# EasyEDA Pro project uven2-mk3-cc-driver-25x.eprj, board PCB1
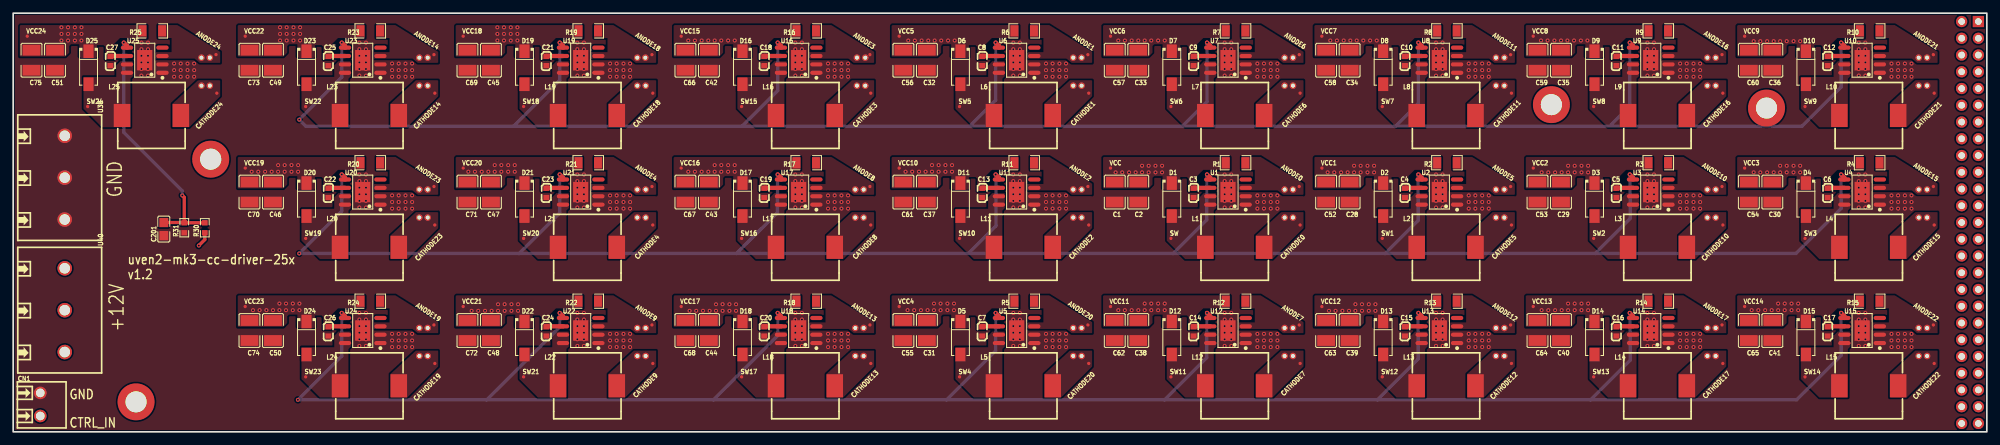
[diagram p2: board, top side]
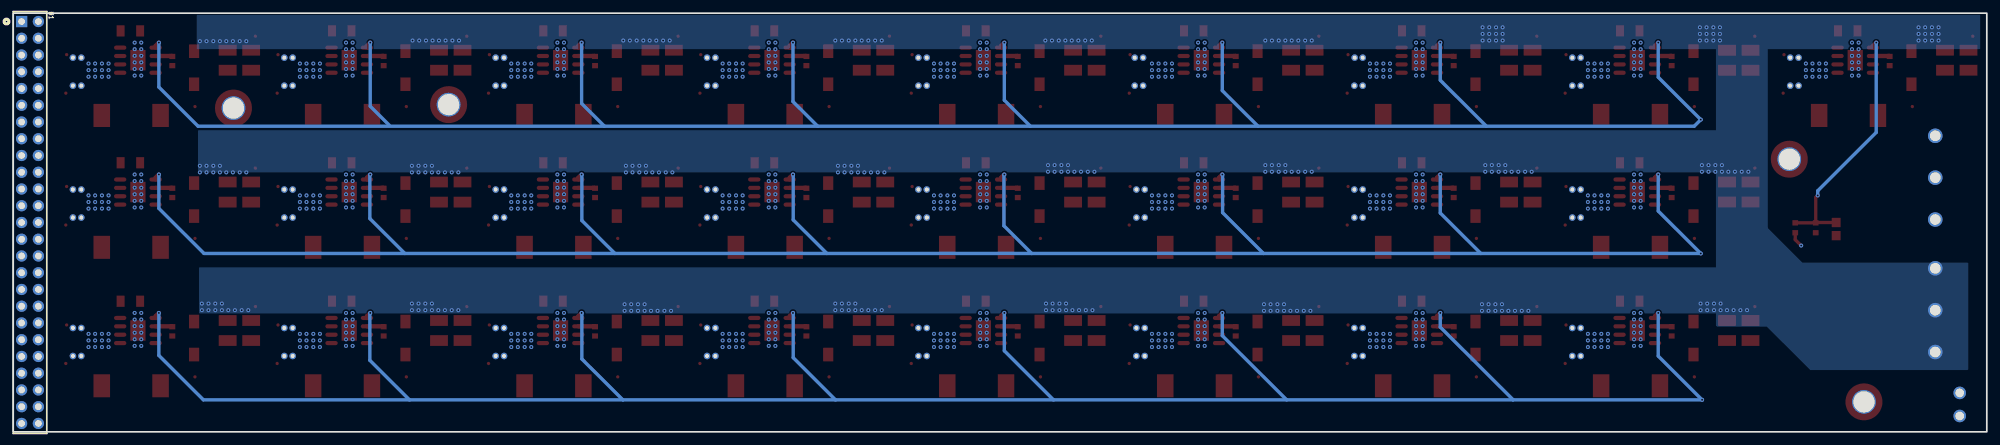
[diagram p3: board, bottom side, seen from below]

Outline 298.79 x 63.5 mm; copper layers: Top Layer, Inner1, Inner2, Bottom Layer. Coordinates in mm from the lower left corner of the outline.
Outline path: rectangle 0,63.5 298.79,0
Stack: Top Layer 0.035mm Outer layer thickness 1oz / Dielectric1 0.2104mm 7628 RC49% 8.6mil / Inner1 0.0152mm Inner layer thickness / Dielectric2 1.065mm 1.1mm H/HOZ Copper / Inner2 0.0152mm Inner layer thickness / Dielectric3 0.2104mm 7628 RC49% 8.6mil / Bottom Layer 0.035mm Outer layer thickness 1oz

## Design rules (mm)
template: Custom Config
spacing copperThickness1oz: track to track 0.102, other pairs 0.152 to 0.3
spacing copperThickness2oz (default): track to track 0.17, other pairs 0.152 to 0.3
track width copperThickness1oz (default): min 0.127, default 0.254, max 2.54
track width copperThickness2oz: min 0.203, default 0.254, max 2.54
differential pair differentialPair (default): width min 0.127, default 0.254, max 2.54; gap min 0.152, default 0.152
via viaSize (default): diameter min 0.5, default 0.61, max 10; hole min 0.3, default 0.305, max 6.3
pour e614 uses copperRegion
pour e1122 uses copperRegion
pour e1120 uses copperRegion
pour e1121 uses copperRegion
pour e1054 uses copperRegion
pour e1053 uses copperRegion
pour e1055 uses copperRegion
pour e1052 uses copperRegion
pour e917 uses copperRegion
pour e918 uses copperRegion
pour e916 uses copperRegion
pour e919 uses copperRegion
pour e815 uses copperRegion
pour e816 uses copperRegion
pour e817 uses copperRegion
pour e814 uses copperRegion
pour e475 uses copperRegion
pour e476 uses copperRegion
pour e474 uses copperRegion
pour e477 uses copperRegion
pour e509 uses copperRegion
pour e510 uses copperRegion
pour e508 uses copperRegion
pour e511 uses copperRegion
pour e543 uses copperRegion
pour e544 uses copperRegion
pour e542 uses copperRegion
pour e545 uses copperRegion
pour e579 uses copperRegion
pour e578 uses copperRegion
pour e577 uses copperRegion
pour e576 uses copperRegion
pour e611 uses copperRegion
pour e612 uses copperRegion
pour e610 uses copperRegion
pour e613 uses copperRegion
pour e782 uses copperRegion
pour e783 uses copperRegion
pour e780 uses copperRegion
pour e781 uses copperRegion
pour e749 uses copperRegion
pour e748 uses copperRegion
pour e746 uses copperRegion
pour e747 uses copperRegion
pour e714 uses copperRegion
pour e713 uses copperRegion
pour e712 uses copperRegion
pour e715 uses copperRegion
pour e680 uses copperRegion
pour e679 uses copperRegion
pour e678 uses copperRegion
pour e681 uses copperRegion
pour e442 uses copperRegion
pour e441 uses copperRegion
pour e440 uses copperRegion
pour e443 uses copperRegion
pour e884 uses copperRegion
pour e883 uses copperRegion
pour e882 uses copperRegion
pour e885 uses copperRegion
pour e1020 uses copperRegion
pour e1018 uses copperRegion
pour e1019 uses copperRegion
pour e1021 uses copperRegion
pour e1088 uses copperRegion
pour e1087 uses copperRegion
pour e1086 uses copperRegion
pour e1089 uses copperRegion
pour e409 uses copperRegion
pour e406 uses copperRegion
pour e407 uses copperRegion
pour e408 uses copperRegion
pour e374 uses copperRegion
pour e375 uses copperRegion
pour e372 uses copperRegion
pour e373 uses copperRegion
pour e339 uses copperRegion
pour e338 uses copperRegion
pour e341 uses copperRegion
pour e340 uses copperRegion
pour e305 uses copperRegion
pour e304 uses copperRegion
pour e307 uses copperRegion
pour e306 uses copperRegion
pour e646 uses copperRegion
pour e645 uses copperRegion
pour e644 uses copperRegion
pour e647 uses copperRegion
pour e849 uses copperRegion
pour e848 uses copperRegion
pour e850 uses copperRegion
pour e851 uses copperRegion
pour e984 uses copperRegion
pour e985 uses copperRegion
pour e986 uses copperRegion
pour e987 uses copperRegion
pour e951 uses copperRegion
pour e950 uses copperRegion
pour e953 uses copperRegion
pour e952 uses copperRegion
pour e2573 uses copperRegion
pour e2685 uses copperRegion
pour e2724 uses copperRegion
pour e2941 uses copperRegion
pour e2625 uses copperRegion

## Placement (name value [footprint] x y rotation side)
ANODE0  -  [Test-Point-0.5mm]  194.7 37.21 0 top
ANODE1  -  [Test-Point-0.5mm]  162.7 57.21 0 top
ANODE2  -  [Test-Point-0.5mm]  162.7 37.21 0 top
ANODE3  -  [Test-Point-0.5mm]  129.7 57.21 0 top
ANODE4  -  [Test-Point-0.5mm]  96.7 37.21 0 top
ANODE5  -  [Test-Point-0.5mm]  226.7 37.21 0 top
ANODE6  -  [Test-Point-0.5mm]  194.7 57.21 0 top
ANODE7  -  [Test-Point-0.5mm]  194.7 16.21 0 top
ANODE8  -  [Test-Point-0.5mm]  129.7 37.21 0 top
ANODE9  -  [Test-Point-0.5mm]  96.7 16.21 0 top
ANODE10  -  [Test-Point-0.5mm]  258.7 37.21 0 top
ANODE11  -  [Test-Point-0.5mm]  226.7 57.21 0 top
ANODE12  -  [Test-Point-0.5mm]  226.7 16.21 0 top
ANODE13  -  [Test-Point-0.5mm]  129.7 16.21 0 top
ANODE14  -  [Test-Point-0.5mm]  63.7 57.21 0 top
ANODE15  -  [Test-Point-0.5mm]  290.7 37.21 0 top
ANODE16  -  [Test-Point-0.5mm]  258.7 57.21 0 top
ANODE17  -  [Test-Point-0.5mm]  258.7 16.21 0 top
ANODE18  -  [Test-Point-0.5mm]  96.7 57.21 0 top
ANODE19  -  [Test-Point-0.5mm]  63.7 16.21 0 top
ANODE20  -  [Test-Point-0.5mm]  162.7 16.21 0 top
ANODE21  -  [Test-Point-0.5mm]  290.7 57.21 0 top
ANODE22  -  [Test-Point-0.5mm]  290.7 16.21 0 top
ANODE23  -  [Test-Point-0.5mm]  63.7 37.21 0 top
ANODE24  -  [Test-Point-0.5mm]  30.7 57.21 0 top
C1  4.7uF  [C1210]  166.77 36.36 90 top
C2  4.7uF  [C1210]  170.32 36.36 90 top
C3  100nF  [C0603]  178.71 36.24 90 top
C4  100nF  [C0603]  210.71 36.24 90 top
C5  100nF  [C0603]  242.71 36.24 90 top
C6  100nF  [C0603]  274.71 36.24 90 top
C7  100nF  [C0603]  146.71 15.24 90 top
C8  100nF  [C0603]  146.71 56.24 90 top
C9  100nF  [C0603]  178.71 56.24 90 top
C10  100nF  [C0603]  210.71 56.24 90 top
C11  100nF  [C0603]  242.71 56.24 90 top
C12  100nF  [C0603]  274.71 56.24 90 top
C13  100nF  [C0603]  146.71 36.24 90 top
C14  100nF  [C0603]  178.71 15.24 90 top
C15  100nF  [C0603]  210.71 15.24 90 top
C16  100nF  [C0603]  242.71 15.24 90 top
C17  100nF  [C0603]  274.71 15.24 90 top
C18  100nF  [C0603]  113.71 56.24 90 top
C19  100nF  [C0603]  113.71 36.24 90 top
C20  100nF  [C0603]  113.71 15.24 90 top
C21  100nF  [C0603]  80.71 56.24 90 top
C22  100nF  [C0603]  47.71 36.24 90 top
C23  100nF  [C0603]  80.71 36.24 90 top
C24  100nF  [C0603]  80.71 15.24 90 top
C25  100nF  [C0603]  47.71 56.24 90 top
C26  100nF  [C0603]  47.71 15.24 90 top
C27  100nF  [C0603]  14.71 56.24 90 top
C28  4.7uF  [C1210]  202.32 36.36 90 top
C29  4.7uF  [C1210]  234.32 36.36 90 top
C30  4.7uF  [C1210]  266.32 36.36 90 top
C31  4.7uF  [C1210]  138.32 15.36 90 top
C32  4.7uF  [C1210]  138.32 56.36 90 top
C33  4.7uF  [C1210]  170.32 56.36 90 top
C34  4.7uF  [C1210]  202.32 56.36 90 top
C35  4.7uF  [C1210]  234.32 56.36 90 top
C36  4.7uF  [C1210]  266.32 56.36 90 top
C37  4.7uF  [C1210]  138.32 36.36 90 top
C38  4.7uF  [C1210]  170.32 15.36 90 top
C39  4.7uF  [C1210]  202.32 15.36 90 top
C40  4.7uF  [C1210]  234.32 15.36 90 top
C41  4.7uF  [C1210]  266.32 15.36 90 top
C42  4.7uF  [C1210]  105.33 56.36 90 top
C43  4.7uF  [C1210]  105.33 36.36 90 top
C44  4.7uF  [C1210]  105.33 15.36 90 top
C45  4.7uF  [C1210]  72.33 56.36 90 top
C46  4.7uF  [C1210]  39.33 36.36 90 top
C47  4.7uF  [C1210]  72.33 36.36 90 top
C48  4.7uF  [C1210]  72.33 15.36 90 top
C49  4.7uF  [C1210]  39.33 56.36 90 top
C50  4.7uF  [C1210]  39.33 15.36 90 top
C51  4.7uF  [C1210]  6.33 56.36 90 top
C52  4.7uF  [C1210]  198.77 36.36 90 top
C53  4.7uF  [C1210]  230.77 36.36 90 top
C54  4.7uF  [C1210]  262.77 36.36 90 top
C55  4.7uF  [C1210]  134.77 15.36 90 top
C56  4.7uF  [C1210]  134.77 56.36 90 top
C57  4.7uF  [C1210]  166.77 56.36 90 top
C58  4.7uF  [C1210]  198.77 56.36 90 top
C59  4.7uF  [C1210]  230.77 56.36 90 top
C60  4.7uF  [C1210]  262.77 56.36 90 top
C61  4.7uF  [C1210]  134.77 36.36 90 top
C62  4.7uF  [C1210]  166.77 15.36 90 top
C63  4.7uF  [C1210]  198.77 15.36 90 top
C64  4.7uF  [C1210]  230.77 15.36 90 top
C65  4.7uF  [C1210]  262.77 15.36 90 top
C66  4.7uF  [C1210]  101.77 56.36 90 top
C67  4.7uF  [C1210]  101.77 36.36 90 top
C68  4.7uF  [C1210]  101.77 15.36 90 top
C69  4.7uF  [C1210]  68.77 56.36 90 top
C70  4.7uF  [C1210]  35.77 36.36 90 top
C71  4.7uF  [C1210]  68.77 36.36 90 top
C72  4.7uF  [C1210]  68.77 15.36 90 top
C73  4.7uF  [C1210]  35.77 56.36 90 top
C74  4.7uF  [C1210]  35.77 15.36 90 top
C75  4.7uF  [C1210]  2.77 56.36 90 top
C201  1uF  [C0805]  22.8 30.75 90 top
CATHODE0  -  [Test-Point-0.5mm]  194.83 31.37 0 top
CATHODE1  -  [Test-Point-0.5mm]  162.83 51.37 0 top
CATHODE2  -  [Test-Point-0.5mm]  162.83 31.37 0 top
CATHODE3  -  [Test-Point-0.5mm]  129.83 51.37 0 top
CATHODE4  -  [Test-Point-0.5mm]  96.83 31.37 0 top
CATHODE5  -  [Test-Point-0.5mm]  226.83 31.37 0 top
CATHODE6  -  [Test-Point-0.5mm]  194.83 51.37 0 top
CATHODE7  -  [Test-Point-0.5mm]  194.83 10.37 0 top
CATHODE8  -  [Test-Point-0.5mm]  129.83 31.37 0 top
CATHODE9  -  [Test-Point-0.5mm]  96.83 10.37 0 top
CATHODE10  -  [Test-Point-0.5mm]  258.83 31.37 0 top
CATHODE11  -  [Test-Point-0.5mm]  226.83 51.37 0 top
CATHODE12  -  [Test-Point-0.5mm]  226.83 10.37 0 top
CATHODE13  -  [Test-Point-0.5mm]  129.83 10.37 0 top
CATHODE14  -  [Test-Point-0.5mm]  63.83 51.37 0 top
CATHODE15  -  [Test-Point-0.5mm]  290.83 31.37 0 top
CATHODE16  -  [Test-Point-0.5mm]  258.83 51.37 0 top
CATHODE17  -  [Test-Point-0.5mm]  258.83 10.37 0 top
CATHODE18  -  [Test-Point-0.5mm]  96.83 51.37 0 top
CATHODE19  -  [Test-Point-0.5mm]  63.83 10.37 0 top
CATHODE20  -  [Test-Point-0.5mm]  162.83 10.37 0 top
CATHODE21  -  [Test-Point-0.5mm]  290.83 51.37 0 top
CATHODE22  -  [Test-Point-0.5mm]  290.83 10.37 0 top
CATHODE23  -  [Test-Point-0.5mm]  63.83 31.37 0 top
CATHODE24  -  [Test-Point-0.5mm]  30.83 51.37 0 top
CN1  DG381-3.5-02P-14-00A(H)  [CONN-TH_2P-P3.50_DG381-3.5-02P-14-00A]  4.1 4.15 270 top
D1  SS54  [SMA_L4.4-W2.8-LS5.4-R-RD]  175.41 35.22 270 top
D2  SS54  [SMA_L4.4-W2.8-LS5.4-R-RD]  207.41 35.22 270 top
D3  SS54  [SMA_L4.4-W2.8-LS5.4-R-RD]  239.41 35.22 270 top
D4  SS54  [SMA_L4.4-W2.8-LS5.4-R-RD]  271.4 35.22 270 top
D5  SS54  [SMA_L4.4-W2.8-LS5.4-R-RD]  143.41 14.22 270 top
D6  SS54  [SMA_L4.4-W2.8-LS5.4-R-RD]  143.41 55.22 270 top
D7  SS54  [SMA_L4.4-W2.8-LS5.4-R-RD]  175.41 55.22 270 top
D8  SS54  [SMA_L4.4-W2.8-LS5.4-R-RD]  207.41 55.22 270 top
D9  SS54  [SMA_L4.4-W2.8-LS5.4-R-RD]  239.41 55.22 270 top
D10  SS54  [SMA_L4.4-W2.8-LS5.4-R-RD]  271.4 55.22 270 top
D11  SS54  [SMA_L4.4-W2.8-LS5.4-R-RD]  143.41 35.22 270 top
D12  SS54  [SMA_L4.4-W2.8-LS5.4-R-RD]  175.41 14.22 270 top
D13  SS54  [SMA_L4.4-W2.8-LS5.4-R-RD]  207.41 14.22 270 top
D14  SS54  [SMA_L4.4-W2.8-LS5.4-R-RD]  239.41 14.22 270 top
D15  SS54  [SMA_L4.4-W2.8-LS5.4-R-RD]  271.4 14.22 270 top
D16  SS54  [SMA_L4.4-W2.8-LS5.4-R-RD]  110.41 55.22 270 top
D17  SS54  [SMA_L4.4-W2.8-LS5.4-R-RD]  110.41 35.22 270 top
D18  SS54  [SMA_L4.4-W2.8-LS5.4-R-RD]  110.41 14.22 270 top
D19  SS54  [SMA_L4.4-W2.8-LS5.4-R-RD]  77.41 55.22 270 top
D20  SS54  [SMA_L4.4-W2.8-LS5.4-R-RD]  44.41 35.22 270 top
D21  SS54  [SMA_L4.4-W2.8-LS5.4-R-RD]  77.41 35.22 270 top
D22  SS54  [SMA_L4.4-W2.8-LS5.4-R-RD]  77.41 14.22 270 top
D23  SS54  [SMA_L4.4-W2.8-LS5.4-R-RD]  44.41 55.22 270 top
D24  SS54  [SMA_L4.4-W2.8-LS5.4-R-RD]  44.41 14.22 270 top
D25  SS54  [SMA_L4.4-W2.8-LS5.4-R-RD]  11.4 55.22 270 top
H1  ZX-PM2.54-2-25PY  [HDR-TH_50P-P2.54-V-F-R2-C25-S2.54-1]  296.25 31.75 270 bottom
L1  4.7uH  [IND-SMD_L10.2-W10.0_MS104R]  184.93 27.98 0 top
L2  4.7uH  [IND-SMD_L10.2-W10.0_MS104R]  216.93 27.98 0 top
L3  4.7uH  [IND-SMD_L10.2-W10.0_MS104R]  248.93 27.98 0 top
L4  4.7uH  [IND-SMD_L10.2-W10.0_MS104R]  280.93 27.98 0 top
L5  4.7uH  [IND-SMD_L10.2-W10.0_MS104R]  152.93 6.98 0 top
L6  4.7uH  [IND-SMD_L10.2-W10.0_MS104R]  152.93 47.98 0 top
L7  4.7uH  [IND-SMD_L10.2-W10.0_MS104R]  184.93 47.98 0 top
L8  4.7uH  [IND-SMD_L10.2-W10.0_MS104R]  216.93 47.98 0 top
L9  4.7uH  [IND-SMD_L10.2-W10.0_MS104R]  248.93 47.98 0 top
L10  4.7uH  [IND-SMD_L10.2-W10.0_MS104R]  280.93 47.98 0 top
L11  4.7uH  [IND-SMD_L10.2-W10.0_MS104R]  152.93 27.98 0 top
L12  4.7uH  [IND-SMD_L10.2-W10.0_MS104R]  184.93 6.98 0 top
L13  4.7uH  [IND-SMD_L10.2-W10.0_MS104R]  216.93 6.98 0 top
L14  4.7uH  [IND-SMD_L10.2-W10.0_MS104R]  248.93 6.98 0 top
L15  4.7uH  [IND-SMD_L10.2-W10.0_MS104R]  280.93 6.98 0 top
L16  4.7uH  [IND-SMD_L10.2-W10.0_MS104R]  119.93 47.98 0 top
L17  4.7uH  [IND-SMD_L10.2-W10.0_MS104R]  119.93 27.98 0 top
L18  4.7uH  [IND-SMD_L10.2-W10.0_MS104R]  119.93 6.98 0 top
L19  4.7uH  [IND-SMD_L10.2-W10.0_MS104R]  86.93 47.98 0 top
L20  4.7uH  [IND-SMD_L10.2-W10.0_MS104R]  53.93 27.98 0 top
L21  4.7uH  [IND-SMD_L10.2-W10.0_MS104R]  86.93 27.98 0 top
L22  4.7uH  [IND-SMD_L10.2-W10.0_MS104R]  86.93 6.98 0 top
L23  4.7uH  [IND-SMD_L10.2-W10.0_MS104R]  53.93 47.98 0 top
L24  4.7uH  [IND-SMD_L10.2-W10.0_MS104R]  53.93 6.98 0 top
L25  4.7uH  [IND-SMD_L10.2-W10.0_MS104R]  20.93 47.98 0 top
NOREF  -  [Pad_e2712]  224.48 52.5 0 top
NOREF#2  -  [Pad_e2765]  95.75 11.5 0 top
NOREF#3  -  [Pad_e2789]  289.75 11.5 0 top
NOREF#4  -  [Pad_e2735]  224.48 36.75 0 top
NOREF#5  -  [Pad_e2730]  257.75 36.75 0 top
NOREF#6  -  [Pad_e2782]  257.75 15.75 0 top
NOREF#7  -  [Pad_e2787]  288.48 15.75 0 top
NOREF#8  -  [Pad_e2785]  257.75 11.5 0 top
NOREF#9  -  [Pad_e2718]  289.75 56.75 0 top
NOREF#10  -  [Pad_e2786]  289.75 15.75 0 top
NOREF#11  -  [Pad_e2783]  256.48 15.75 0 top
NOREF#12  -  [Pad_e2749]  128.75 32.5 0 top
NOREF#13  -  [Pad_e2727]  288.48 36.75 0 top
NOREF#14  -  [Pad_e2720]  288.48 52.5 0 top
NOREF#15  -  [Pad_e2763]  94.48 15.75 0 top
NOREF#16  -  [Pad_e2691]  61.48 56.75 0 top
NOREF#17  -  [Pad_e2682]  28.5 56.75 0 top
NOREF#18  -  [Pad_e2703]  160.48 56.75 0 top
NOREF#19  -  [Pad_e2757]  62.75 32.5 0 top
NOREF#20  -  [Pad_e2752]  94.48 32.5 0 top
NOREF#21  -  [Pad_e2781]  225.75 11.5 0 top
NOREF#22  -  [Pad_e2740]  192.48 32.5 0 top
NOREF#23  -  [Pad_e2729]  289.75 32.5 0 top
NOREF#24  -  [Pad_e2737]  225.75 32.5 0 top
NOREF#25  -  [Pad_e2751]  94.48 36.75 0 top
NOREF#26  -  [Pad_e2709]  193.75 52.5 0 top
NOREF#27  -  [Pad_e2714]  257.75 56.75 0 top
NOREF#28  -  [Pad_e2748]  127.48 32.5 0 top
NOREF#29  -  [Pad_e2736]  224.48 32.5 0 top
NOREF#30  -  [Pad_e2764]  94.48 11.5 0 top
NOREF#31  -  [Pad_e2773]  161.75 11.5 0 top
NOREF#32  -  [Pad_e2768]  127.48 11.5 0 top
NOREF#33  -  [Pad_e2777]  193.75 11.5 0 top
NOREF#34  -  [Pad_e2759]  61.48 15.75 0 top
NOREF#35  -  [Pad_e2755]  61.48 36.75 0 top
NOREF#36  -  [Pad_e2708]  192.48 52.5 0 top
NOREF#37  -  [Pad_e2753]  95.75 32.5 0 top
NOREF#38  -  [Pad_e2717]  257.75 52.5 0 top
NOREF#39  -  [Pad_e2728]  288.48 32.5 0 top
NOREF#40  -  [Pad_e2738]  193.75 36.75 0 top
NOREF#41  -  [Pad_e2754]  62.75 36.75 0 top
NOREF#42  -  [Pad_e2741]  193.75 32.5 0 top
NOREF#43  -  [Pad_e2784]  256.48 11.5 0 top
NOREF#44  -  [Pad_e2702]  161.75 56.75 0 top
NOREF#45  -  [Pad_e2706]  193.75 56.75 0 top
NOREF#46  -  [Pad_e2704]  160.48 52.5 0 top
NOREF#47  -  [Pad_e2701]  129 52.5 0 top
NOREF#48  -  [Pad_e2744]  160.48 32.5 0 top
NOREF#49  -  [Pad_e2776]  192.48 11.5 0 top
NOREF#50  -  [Pad_e2684]  29.77 56.75 0 top
NOREF#51  -  [Pad_e2710]  225.75 56.75 0 top
NOREF#52  -  [Pad_e2779]  224.48 15.75 0 top
NOREF#53  -  [Pad_e2733]  257.75 32.5 0 top
NOREF#54  -  [Pad_e2721]  289.75 52.5 0 top
NOREF#55  -  [Pad_e2711]  224.48 56.75 0 top
NOREF#56  -  [Pad_e2693]  62.75 52.5 0 top
NOREF#57  -  [Pad_e2762]  95.75 15.75 0 top
NOREF#58  -  [Pad_e2761]  62.75 11.5 0 top
NOREF#59  -  [Pad_e2734]  225.75 36.75 0 top
NOREF#60  -  [Pad_e2700]  127.73 52.5 0 top
NOREF#61  -  [Pad_e2750]  95.75 36.75 0 top
NOREF#62  -  [Pad_e2699]  127.73 56.75 0 top
NOREF#63  -  [Pad_e1214]  95.7 56.75 0 top
NOREF#64  -  [Pad_e2707]  192.48 56.75 0 top
NOREF#65  -  [Pad_e2780]  224.48 11.5 0 top
NOREF#66  -  [Pad_e2688]  29.77 52.5 0 top
NOREF#67  -  [Pad_e2697]  95.75 52.5 0 top
NOREF#68  -  [Pad_e2719]  288.48 56.75 0 top
NOREF#69  -  [Pad_e2743]  160.48 36.75 0 top
NOREF#70  -  [Pad_e2732]  256.48 32.5 0 top
NOREF#71  -  [Pad_e2742]  161.75 36.75 0 top
NOREF#72  -  [Pad_e2771]  160.48 15.75 0 top
NOREF#73  -  [Pad_e1244]  61.48 52.5 0 top
NOREF#74  -  [Pad_e2766]  128.75 15.75 0 top
NOREF#75  -  [Pad_e2705]  161.75 52.5 0 top
NOREF#76  -  [Pad_e2687]  28.5 52.5 0 top
NOREF#77  -  [Pad_e2695]  94.48 56.75 0 top
NOREF#78  -  [Pad_e1213]  129 56.75 0 top
NOREF#79  -  [Pad_e2739]  192.48 36.75 0 top
NOREF#80  -  [Pad_e2758]  62.75 15.75 0 top
NOREF#81  -  [Pad_e2760]  61.48 11.5 0 top
NOREF#82  -  [Pad_e2775]  192.48 15.75 0 top
NOREF#83  -  [Pad_e2770]  161.75 15.75 0 top
NOREF#84  -  [Pad_e2745]  161.75 32.5 0 top
NOREF#85  -  [Pad_e2713]  225.75 52.5 0 top
NOREF#86  -  [Pad_e2747]  127.48 36.75 0 top
NOREF#87  -  [Pad_e2769]  128.75 11.5 0 top
NOREF#88  -  [Pad_e2726]  289.75 36.75 0 top
NOREF#89  -  [Pad_e2696]  94.48 52.5 0 top
NOREF#90  -  [Pad_e2778]  225.75 15.75 0 top
NOREF#91  -  [Pad_e2774]  193.75 15.75 0 top
NOREF#92  -  [Pad_e2716]  256.48 52.5 0 top
NOREF#93  -  [Pad_e2690]  62.75 56.75 0 top
NOREF#94  -  [Pad_e2715]  256.48 56.75 0 top
NOREF#95  -  [Pad_e2731]  256.48 36.75 0 top
NOREF#96  -  [Pad_e2788]  288.48 11.5 0 top
NOREF#97  -  [Pad_e2767]  127.48 15.75 0 top
NOREF#98  -  [Pad_e2746]  128.75 36.75 0 top
NOREF#99  -  [Pad_e2772]  160.48 11.5 0 top
NOREF#100  -  [Pad_e2756]  61.48 32.5 0 top
R1  50mΩ  [R1206]  185.06 40.81 0 top
R2  50mΩ  [R1206]  217.06 40.81 0 top
R3  50mΩ  [R1206]  249.06 40.81 0 top
R4  50mΩ  [R1206]  281.06 40.81 0 top
R5  50mΩ  [R1206]  153.06 19.81 0 top
R6  50mΩ  [R1206]  153.06 60.81 0 top
R7  50mΩ  [R1206]  185.06 60.81 0 top
R8  50mΩ  [R1206]  217.06 60.81 0 top
R9  50mΩ  [R1206]  249.06 60.81 0 top
R10  50mΩ  [R1206]  281.06 60.81 0 top
R11  50mΩ  [R1206]  153.06 40.81 0 top
R12  50mΩ  [R1206]  185.06 19.81 0 top
R13  50mΩ  [R1206]  217.06 19.81 0 top
R14  50mΩ  [R1206]  249.06 19.81 0 top
R15  50mΩ  [R1206]  281.06 19.81 0 top
R16  50mΩ  [R1206]  120.06 60.81 0 top
R17  50mΩ  [R1206]  120.06 40.81 0 top
R18  50mΩ  [R1206]  120.06 19.81 0 top
R19  50mΩ  [R1206]  87.06 60.81 0 top
R20  50mΩ  [R1206]  54.06 40.81 0 top
R21  50mΩ  [R1206]  87.06 40.81 0 top
R22  50mΩ  [R1206]  87.06 19.81 0 top
R23  50mΩ  [R1206]  54.06 60.81 0 top
R24  50mΩ  [R1206]  54.06 19.81 0 top
R25  50mΩ  [R1206]  21.06 60.81 0 top
R30  100Ω  [R0603]  29 30.95 90 top
R31  4.7kΩ  [R0603]  25.9 30.95 90 top
SW  -  [Test-Point-0.5mm]  175.27 29.33 0 top
SW1  -  [Test-Point-0.5mm]  207.27 29.33 0 top
SW2  -  [Test-Point-0.5mm]  239.27 29.33 0 top
SW3  -  [Test-Point-0.5mm]  271.27 29.33 0 top
SW4  -  [Test-Point-0.5mm]  143.27 8.33 0 top
SW5  -  [Test-Point-0.5mm]  143.27 49.33 0 top
SW6  -  [Test-Point-0.5mm]  175.27 49.33 0 top
SW7  -  [Test-Point-0.5mm]  207.27 49.33 0 top
SW8  -  [Test-Point-0.5mm]  239.27 49.33 0 top
SW9  -  [Test-Point-0.5mm]  271.27 49.33 0 top
SW10  -  [Test-Point-0.5mm]  143.27 29.33 0 top
SW11  -  [Test-Point-0.5mm]  175.27 8.33 0 top
SW12  -  [Test-Point-0.5mm]  207.27 8.33 0 top
SW13  -  [Test-Point-0.5mm]  239.27 8.33 0 top
SW14  -  [Test-Point-0.5mm]  271.27 8.33 0 top
SW15  -  [Test-Point-0.5mm]  110.27 49.33 0 top
SW16  -  [Test-Point-0.5mm]  110.27 29.33 0 top
SW17  -  [Test-Point-0.5mm]  110.27 8.33 0 top
SW18  -  [Test-Point-0.5mm]  77.27 49.33 0 top
SW19  -  [Test-Point-0.5mm]  44.27 29.33 0 top
SW20  -  [Test-Point-0.5mm]  77.27 29.33 0 top
SW21  -  [Test-Point-0.5mm]  77.27 8.33 0 top
SW22  -  [Test-Point-0.5mm]  44.27 49.33 0 top
SW23  -  [Test-Point-0.5mm]  44.27 8.33 0 top
SW24  -  [Test-Point-0.5mm]  11.27 49.33 0 top
U1  AL8843QSP-13  [SOIC-8_L4.9-W3.9-P1.27-LS6.0-BL-EP3.1-1]  183.91 36.36 90 top
U2  AL8843QSP-13  [SOIC-8_L4.9-W3.9-P1.27-LS6.0-BL-EP3.1-1]  215.91 36.36 90 top
U3  AL8843QSP-13  [SOIC-8_L4.9-W3.9-P1.27-LS6.0-BL-EP3.1-1]  247.91 36.36 90 top
U4  AL8843QSP-13  [SOIC-8_L4.9-W3.9-P1.27-LS6.0-BL-EP3.1-1]  279.91 36.36 90 top
U5  AL8843QSP-13  [SOIC-8_L4.9-W3.9-P1.27-LS6.0-BL-EP3.1-1]  151.91 15.36 90 top
U6  AL8843QSP-13  [SOIC-8_L4.9-W3.9-P1.27-LS6.0-BL-EP3.1-1]  151.91 56.36 90 top
U7  AL8843QSP-13  [SOIC-8_L4.9-W3.9-P1.27-LS6.0-BL-EP3.1-1]  183.91 56.36 90 top
U8  AL8843QSP-13  [SOIC-8_L4.9-W3.9-P1.27-LS6.0-BL-EP3.1-1]  215.91 56.36 90 top
U9  AL8843QSP-13  [SOIC-8_L4.9-W3.9-P1.27-LS6.0-BL-EP3.1-1]  247.91 56.36 90 top
U10  AL8843QSP-13  [SOIC-8_L4.9-W3.9-P1.27-LS6.0-BL-EP3.1-1]  279.91 56.36 90 top
U11  AL8843QSP-13  [SOIC-8_L4.9-W3.9-P1.27-LS6.0-BL-EP3.1-1]  151.91 36.36 90 top
U12  AL8843QSP-13  [SOIC-8_L4.9-W3.9-P1.27-LS6.0-BL-EP3.1-1]  183.91 15.36 90 top
U13  AL8843QSP-13  [SOIC-8_L4.9-W3.9-P1.27-LS6.0-BL-EP3.1-1]  215.91 15.36 90 top
U14  AL8843QSP-13  [SOIC-8_L4.9-W3.9-P1.27-LS6.0-BL-EP3.1-1]  247.91 15.36 90 top
U15  AL8843QSP-13  [SOIC-8_L4.9-W3.9-P1.27-LS6.0-BL-EP3.1-1]  279.91 15.36 90 top
U16  AL8843QSP-13  [SOIC-8_L4.9-W3.9-P1.27-LS6.0-BL-EP3.1-1]  118.91 56.36 90 top
U17  AL8843QSP-13  [SOIC-8_L4.9-W3.9-P1.27-LS6.0-BL-EP3.1-1]  118.91 36.36 90 top
U18  AL8843QSP-13  [SOIC-8_L4.9-W3.9-P1.27-LS6.0-BL-EP3.1-1]  118.91 15.36 90 top
U19  AL8843QSP-13  [SOIC-8_L4.9-W3.9-P1.27-LS6.0-BL-EP3.1-1]  85.91 56.36 90 top
U20  AL8843QSP-13  [SOIC-8_L4.9-W3.9-P1.27-LS6.0-BL-EP3.1-1]  52.91 36.36 90 top
U21  AL8843QSP-13  [SOIC-8_L4.9-W3.9-P1.27-LS6.0-BL-EP3.1-1]  85.91 36.36 90 top
U22  AL8843QSP-13  [SOIC-8_L4.9-W3.9-P1.27-LS6.0-BL-EP3.1-1]  85.91 15.36 90 top
U23  AL8843QSP-13  [SOIC-8_L4.9-W3.9-P1.27-LS6.0-BL-EP3.1-1]  52.91 56.36 90 top
U24  AL8843QSP-13  [SOIC-8_L4.9-W3.9-P1.27-LS6.0-BL-EP3.1-1]  52.91 15.36 90 top
U25  AL8843QSP-13  [SOIC-8_L4.9-W3.9-P1.27-LS6.0-BL-EP3.1-1]  19.91 56.36 90 top
U32  MountingHole_M3_Pad  [MountingHole_3.2mm_M3_DIN965_Pad_TopOnly]  18.6 4.54 0 top
U33  MountingHole_M3_Pad  [MountingHole_3.2mm_M3_DIN965_Pad_TopOnly]  265.45 49.1 0 top
U36  MountingHole_M3_Pad  [MountingHole_3.2mm_M3_DIN965_Pad_TopOnly]  29.9 41.35 0 top
U37  MountingHole_M3_Pad  [MountingHole_3.2mm_M3_DIN965_Pad_TopOnly]  232.88 49.62 0 top
U38  MX635-6.35-03P-GN01-Cu-PS-A  [CONN-TH_MX635-6.35-03P-GN01-CU-PS-A]  7.8 38.55 270 top
U40  MX635-6.35-03P-GN01-Cu-PS-A  [CONN-TH_MX635-6.35-03P-GN01-CU-PS-A]  7.8 18.45 270 top
VCC  -  [Test-Point-0.5mm]  166.13 40 0 top
VCC1  -  [Test-Point-0.5mm]  198.13 40 0 top
VCC2  -  [Test-Point-0.5mm]  230.13 40 0 top
VCC3  -  [Test-Point-0.5mm]  262.13 40 0 top
VCC4  -  [Test-Point-0.5mm]  134.13 19 0 top
VCC5  -  [Test-Point-0.5mm]  134.13 60 0 top
VCC6  -  [Test-Point-0.5mm]  166.13 60 0 top
VCC7  -  [Test-Point-0.5mm]  198.13 60 0 top
VCC8  -  [Test-Point-0.5mm]  230.13 60 0 top
VCC9  -  [Test-Point-0.5mm]  262.13 60 0 top
VCC10  -  [Test-Point-0.5mm]  134.13 40 0 top
VCC11  -  [Test-Point-0.5mm]  166.13 19 0 top
VCC12  -  [Test-Point-0.5mm]  198.13 19 0 top
VCC13  -  [Test-Point-0.5mm]  230.13 19 0 top
VCC14  -  [Test-Point-0.5mm]  262.13 19 0 top
VCC15  -  [Test-Point-0.5mm]  101.13 60 0 top
VCC16  -  [Test-Point-0.5mm]  101.13 40 0 top
VCC17  -  [Test-Point-0.5mm]  101.13 19 0 top
VCC18  -  [Test-Point-0.5mm]  68.13 60 0 top
VCC19  -  [Test-Point-0.5mm]  35.13 40 0 top
VCC20  -  [Test-Point-0.5mm]  68.13 40 0 top
VCC21  -  [Test-Point-0.5mm]  68.13 19 0 top
VCC22  -  [Test-Point-0.5mm]  35.13 60 0 top
VCC23  -  [Test-Point-0.5mm]  35.13 19 0 top
VCC24  -  [Test-Point-0.5mm]  2.13 60 0 top

## Footprints (pads in the part's own frame, mm; a bottom-side part is the same pattern mirrored in y, then rotated)
C0603
  rect 0.8x0.9 smd: 1(-0.7,0) 2(0.7,0)
C0805
  rect 1.41x1.35 smd: 1(-1,0) 2(1,0)
C1210
  rect 1.635x2.7 smd: 1(-1.518,0) 2(1.518,0)
CONN-TH_2P-P3.50_DG381-3.5-02P-14-00A
  round 1.9 hole 1.3: 1(-1.75,0) 2(1.75,0)
CONN-TH_MX635-6.35-03P-GN01-CU-PS-A
  round 2.2 hole 1.6: 1(-6.35,0) 2(0,0) 3(6.35,0)
HDR-TH_50P-P2.54-V-F-R2-C25-S2.54-1
  rect 1.7x1.7 hole 1.02: 1(-30.48,-1.27)
  round 1.7 hole 1.02: 2(-30.48,1.27) 3(-27.94,-1.27) 4(-27.94,1.27) 5(-25.4,-1.27) 6(-25.4,1.27) 7(-22.86,-1.27) 8(-22.86,1.27) 9(-20.32,-1.27) 10(-20.32,1.27) 11(-17.78,-1.27) 12(-17.78,1.27) 13(-15.24,-1.27) 14(-15.24,1.27) 15(-12.7,-1.27) 16(-12.7,1.27) 17(-10.16,-1.27) 18(-10.16,1.27) 19(-7.62,-1.27) 20(-7.62,1.27) 21(-5.08,-1.27) 22(-5.08,1.27) 23(-2.54,-1.27) 24(-2.54,1.27) 25(0,-1.27) 26(0,1.27) 27(2.54,-1.27) 28(2.54,1.27) 29(5.08,-1.27) 30(5.08,1.27) 31(7.62,-1.27) 32(7.62,1.27) 33(10.16,-1.27) 34(10.16,1.27) 35(12.7,-1.27) 36(12.7,1.27) 37(15.24,-1.27) 38(15.24,1.27) 39(17.78,-1.27) 40(17.78,1.27) 41(20.32,-1.27) 42(20.32,1.27) 43(22.86,-1.27) 44(22.86,1.27) 45(25.4,-1.27) 46(25.4,1.27) 47(27.94,-1.27) 48(27.94,1.27) 49(30.48,-1.27) 50(30.48,1.27)
IND-SMD_L10.2-W10.0_MS104R
  rect 2.5x3.5 smd: 1(-4.45,0) 2(4.45,0)
MountingHole_3.2mm_M3_DIN965_Pad_TopOnly
  round 3.6 hole 3.2: 1(0,0)
  round 5.6 smd: 1(0,0)
Pad_e1213
  round 1 hole 0.6: 1(0,0)
Pad_e1214
  round 1 hole 0.6: 1(0,0)
Pad_e1244
  round 1 hole 0.6: 1(0,0)
Pad_e2682
  round 1 hole 0.6: 1(0,0)
Pad_e2684
  round 1 hole 0.6: 1(0,0)
Pad_e2687
  round 1 hole 0.6: 1(0,0)
Pad_e2688
  round 1 hole 0.6: 1(0,0)
Pad_e2690
  round 1 hole 0.6: 1(0,0)
Pad_e2691
  round 1 hole 0.6: 1(0,0)
Pad_e2693
  round 1 hole 0.6: 1(0,0)
Pad_e2695
  round 1 hole 0.6: 1(0,0)
Pad_e2696
  round 1 hole 0.6: 1(0,0)
Pad_e2697
  round 1 hole 0.6: 1(0,0)
Pad_e2699
  round 1 hole 0.6: 1(0,0)
Pad_e2700
  round 1 hole 0.6: 1(0,0)
Pad_e2701
  round 1 hole 0.6: 1(0,0)
Pad_e2702
  round 1 hole 0.6: 1(0,0)
Pad_e2703
  round 1 hole 0.6: 1(0,0)
Pad_e2704
  round 1 hole 0.6: 1(0,0)
Pad_e2705
  round 1 hole 0.6: 1(0,0)
Pad_e2706
  round 1 hole 0.6: 1(0,0)
Pad_e2707
  round 1 hole 0.6: 1(0,0)
Pad_e2708
  round 1 hole 0.6: 1(0,0)
Pad_e2709
  round 1 hole 0.6: 1(0,0)
Pad_e2710
  round 1 hole 0.6: 1(0,0)
Pad_e2711
  round 1 hole 0.6: 1(0,0)
Pad_e2712
  round 1 hole 0.6: 1(0,0)
Pad_e2713
  round 1 hole 0.6: 1(0,0)
Pad_e2714
  round 1 hole 0.6: 1(0,0)
Pad_e2715
  round 1 hole 0.6: 1(0,0)
Pad_e2716
  round 1 hole 0.6: 1(0,0)
Pad_e2717
  round 1 hole 0.6: 1(0,0)
Pad_e2718
  round 1 hole 0.6: 1(0,0)
Pad_e2719
  round 1 hole 0.6: 1(0,0)
Pad_e2720
  round 1 hole 0.6: 1(0,0)
Pad_e2721
  round 1 hole 0.6: 1(0,0)
Pad_e2726
  round 1 hole 0.6: 1(0,0)
Pad_e2727
  round 1 hole 0.6: 1(0,0)
Pad_e2728
  round 1 hole 0.6: 1(0,0)
Pad_e2729
  round 1 hole 0.6: 1(0,0)
Pad_e2730
  round 1 hole 0.6: 1(0,0)
Pad_e2731
  round 1 hole 0.6: 1(0,0)
Pad_e2732
  round 1 hole 0.6: 1(0,0)
Pad_e2733
  round 1 hole 0.6: 1(0,0)
Pad_e2734
  round 1 hole 0.6: 1(0,0)
Pad_e2735
  round 1 hole 0.6: 1(0,0)
Pad_e2736
  round 1 hole 0.6: 1(0,0)
Pad_e2737
  round 1 hole 0.6: 1(0,0)
Pad_e2738
  round 1 hole 0.6: 1(0,0)
Pad_e2739
  round 1 hole 0.6: 1(0,0)
Pad_e2740
  round 1 hole 0.6: 1(0,0)
Pad_e2741
  round 1 hole 0.6: 1(0,0)
Pad_e2742
  round 1 hole 0.6: 1(0,0)
Pad_e2743
  round 1 hole 0.6: 1(0,0)
Pad_e2744
  round 1 hole 0.6: 1(0,0)
Pad_e2745
  round 1 hole 0.6: 1(0,0)
Pad_e2746
  round 1 hole 0.6: 1(0,0)
Pad_e2747
  round 1 hole 0.6: 1(0,0)
Pad_e2748
  round 1 hole 0.6: 1(0,0)
Pad_e2749
  round 1 hole 0.6: 1(0,0)
Pad_e2750
  round 1 hole 0.6: 1(0,0)
Pad_e2751
  round 1 hole 0.6: 1(0,0)
Pad_e2752
  round 1 hole 0.6: 1(0,0)
Pad_e2753
  round 1 hole 0.6: 1(0,0)
Pad_e2754
  round 1 hole 0.6: 1(0,0)
Pad_e2755
  round 1 hole 0.6: 1(0,0)
Pad_e2756
  round 1 hole 0.6: 1(0,0)
Pad_e2757
  round 1 hole 0.6: 1(0,0)
Pad_e2758
  round 1 hole 0.6: 1(0,0)
Pad_e2759
  round 1 hole 0.6: 1(0,0)
Pad_e2760
  round 1 hole 0.6: 1(0,0)
Pad_e2761
  round 1 hole 0.6: 1(0,0)
Pad_e2762
  round 1 hole 0.6: 1(0,0)
Pad_e2763
  round 1 hole 0.6: 1(0,0)
Pad_e2764
  round 1 hole 0.6: 1(0,0)
Pad_e2765
  round 1 hole 0.6: 1(0,0)
Pad_e2766
  round 1 hole 0.6: 1(0,0)
Pad_e2767
  round 1 hole 0.6: 1(0,0)
Pad_e2768
  round 1 hole 0.6: 1(0,0)
Pad_e2769
  round 1 hole 0.6: 1(0,0)
Pad_e2770
  round 1 hole 0.6: 1(0,0)
Pad_e2771
  round 1 hole 0.6: 1(0,0)
Pad_e2772
  round 1 hole 0.6: 1(0,0)
Pad_e2773
  round 1 hole 0.6: 1(0,0)
Pad_e2774
  round 1 hole 0.6: 1(0,0)
Pad_e2775
  round 1 hole 0.6: 1(0,0)
Pad_e2776
  round 1 hole 0.6: 1(0,0)
Pad_e2777
  round 1 hole 0.6: 1(0,0)
Pad_e2778
  round 1 hole 0.6: 1(0,0)
Pad_e2779
  round 1 hole 0.6: 1(0,0)
Pad_e2780
  round 1 hole 0.6: 1(0,0)
Pad_e2781
  round 1 hole 0.6: 1(0,0)
Pad_e2782
  round 1 hole 0.6: 1(0,0)
Pad_e2783
  round 1 hole 0.6: 1(0,0)
Pad_e2784
  round 1 hole 0.6: 1(0,0)
Pad_e2785
  round 1 hole 0.6: 1(0,0)
Pad_e2786
  round 1 hole 0.6: 1(0,0)
Pad_e2787
  round 1 hole 0.6: 1(0,0)
Pad_e2788
  round 1 hole 0.6: 1(0,0)
Pad_e2789
  round 1 hole 0.6: 1(0,0)
R0603
  rect 0.806x0.864 smd: 1(-0.753,0) 2(0.753,0)
R1206
  rect 1.208x1.701 smd: 1(-1.479,0) 2(1.479,0)
SMA_L4.4-W2.8-LS5.4-R-RD
  rect 2.062x1.539 smd: 1(2.503,0) 2(-2.503,0)
SOIC-8_L4.9-W3.9-P1.27-LS6.0-BL-EP3.1-1
  oval 0.63x1.865 smd: 1(-1.905,-2.683) 2(-0.635,-2.683) 3(0.635,-2.683) 4(1.905,-2.683) 5(1.905,2.683) 6(0.635,2.683) 7(-0.635,2.683) 8(-1.905,2.683)
  rect 3.1x2.3 smd: 9(0,0)
Test-Point-0.5mm
  round 0.5 smd: 1(0,0)

## Nets
GND: C1.1 C2.1 C3.1 C4.1 C5.1 C6.1 C7.1 C8.1 C9.1 C10.1 C11.1 C12.1 C13.1 C14.1 C15.1 C16.1 C17.1 C18.1 C19.1 C20.1 C21.1 C22.1 C23.1 C24.1 C25.1 C26.1 C27.1 C28.1 C29.1 C30.1 C31.1 C32.1 C33.1 C34.1 C35.1 C36.1 C37.1 C38.1 C39.1 C40.1 C41.1 C42.1 C43.1 C44.1 C45.1 C46.1 C47.1 C48.1 C49.1 C50.1 C51.1 C52.1 C53.1 C54.1 C55.1 C56.1 C57.1 C58.1 C59.1 C60.1 C61.1 C62.1 C63.1 C64.1 C65.1 C66.1 C67.1 C68.1 C69.1 C70.1 C71.1 C72.1 C73.1 C74.1 C75.1 C201.1 CN1.1 R31.1 U1.1 U1.2 U1.9 U2.1 U2.2 U2.9 U3.1 U3.2 U3.9 U4.1 U4.2 U4.9 U5.1 U5.2 U5.9 U6.1 U6.2 U6.9 U7.1 U7.2 U7.9 U8.1 U8.2 U8.9 U9.1 U9.2 U9.9 U10.1 U10.2 U10.9 U11.1 U11.2 U11.9 U12.1 U12.2 U12.9 U13.1 U13.2 U13.9 U14.1 U14.2 U14.9 U15.1 U15.2 U15.9 U16.1 U16.2 U16.9 U17.1 U17.2 U17.9 U18.1 U18.2 U18.9 U19.1 U19.2 U19.9 U20.1 U20.2 U20.9 U21.1 U21.2 U21.9 U22.1 U22.2 U22.9 U23.1 U23.2 U23.9 U24.1 U24.2 U24.9 U25.1 U25.2 U25.9 U38.1 U38.2 U38.3
VCC: C1.2 C2.2 C3.2 C4.2 C5.2 C6.2 C7.2 C8.2 C9.2 C10.2 C11.2 C12.2 C13.2 C14.2 C15.2 C16.2 C17.2 C18.2 C19.2 C20.2 C21.2 C22.2 C23.2 C24.2 C25.2 C26.2 C27.2 C28.2 C29.2 C30.2 C31.2 C32.2 C33.2 C34.2 C35.2 C36.2 C37.2 C38.2 C39.2 C40.2 C41.2 C42.2 C43.2 C44.2 C45.2 C46.2 C47.2 C48.2 C49.2 C50.2 C51.2 C52.2 C53.2 C54.2 C55.2 C56.2 C57.2 C58.2 C59.2 C60.2 C61.2 C62.2 C63.2 C64.2 C65.2 C66.2 C67.2 C68.2 C69.2 C70.2 C71.2 C72.2 C73.2 C74.2 C75.2 D1.2 D2.2 D3.2 D4.2 D5.2 D6.2 D7.2 D8.2 D9.2 D10.2 D11.2 D12.2 D13.2 D14.2 D15.2 D16.2 D17.2 D18.2 D19.2 D20.2 D21.2 D22.2 D23.2 D24.2 D25.2 R1.1 R2.1 R3.1 R4.1 R5.1 R6.1 R7.1 R8.1 R9.1 R10.1 R11.1 R12.1 R13.1 R14.1 R15.1 R16.1 R17.1 R18.1 R19.1 R20.1 R21.1 R22.1 R23.1 R24.1 R25.1 U1.6 U2.6 U3.6 U4.6 U5.6 U6.6 U7.6 U8.6 U9.6 U10.6 U11.6 U12.6 U13.6 U14.6 U15.6 U16.6 U17.6 U18.6 U19.6 U20.6 U21.6 U22.6 U23.6 U24.6 U25.6 U40.1 U40.2 U40.3 VCC.1 VCC1.1 VCC2.1 VCC3.1 VCC4.1 VCC5.1 VCC6.1 VCC7.1 VCC8.1 VCC9.1 VCC10.1 VCC11.1 VCC12.1 VCC13.1 VCC14.1 VCC15.1 VCC16.1 VCC17.1 VCC18.1 VCC19.1 VCC20.1 VCC21.1 VCC22.1 VCC23.1 VCC24.1
$1I61\$1N360: D1.1 L1.1 SW.1 U1.7 U1.8
$1I548\$1N360: D2.1 L2.1 SW1.1 U2.7 U2.8
$1I566\$1N360: D3.1 L3.1 SW2.1 U3.7 U3.8
$1I584\$1N360: D4.1 L4.1 SW3.1 U4.7 U4.8
$1I602\$1N360: D5.1 L5.1 SW4.1 U5.7 U5.8
$1I620\$1N360: D6.1 L6.1 SW5.1 U6.7 U6.8
$1I638\$1N360: D7.1 L7.1 SW6.1 U7.7 U7.8
$1I656\$1N360: D8.1 L8.1 SW7.1 U8.7 U8.8
$1I674\$1N360: D9.1 L9.1 SW8.1 U9.7 U9.8
$1I692\$1N360: D10.1 L10.1 SW9.1 U10.7 U10.8
$1I710\$1N360: D11.1 L11.1 SW10.1 U11.7 U11.8
$1I728\$1N360: D12.1 L12.1 SW11.1 U12.7 U12.8
$1I746\$1N360: D13.1 L13.1 SW12.1 U13.7 U13.8
$1I764\$1N360: D14.1 L14.1 SW13.1 U14.7 U14.8
$1I782\$1N360: D15.1 L15.1 SW14.1 U15.7 U15.8
$1I800\$1N360: D16.1 L16.1 SW15.1 U16.7 U16.8
$1I818\$1N360: D17.1 L17.1 SW16.1 U17.7 U17.8
$1I836\$1N360: D18.1 L18.1 SW17.1 U18.7 U18.8
$1I854\$1N360: D19.1 L19.1 SW18.1 U19.7 U19.8
$1I872\$1N360: D20.1 L20.1 SW19.1 U20.7 U20.8
$1I890\$1N360: D21.1 L21.1 SW20.1 U21.7 U21.8
$1I908\$1N360: D22.1 L22.1 SW21.1 U22.7 U22.8
$1I926\$1N360: D23.1 L23.1 SW22.1 U23.7 U23.8
$1I944\$1N360: D24.1 L24.1 SW23.1 U24.7 U24.8
$1I962\$1N360: D25.1 L25.1 SW24.1 U25.7 U25.8
ANODE_0: ANODE0.1 H1.27 NOREF#40.1 NOREF#79.1 R1.2 U1.3
ANODE_1: ANODE1.1 H1.17 NOREF#18.1 NOREF#44.1 R6.2 U6.3
ANODE_2: ANODE2.1 H1.29 NOREF#69.1 NOREF#71.1 R11.2 U11.3
ANODE_3: ANODE3.1 H1.7 NOREF#62.1 NOREF#78.1 R16.2 U16.3
ANODE_4: ANODE4.1 H1.33 NOREF#25.1 NOREF#61.1 R21.2 U21.3
ANODE_5: ANODE5.1 H1.25 NOREF#4.1 NOREF#59.1 R2.2 U2.3
ANODE_6: ANODE6.1 H1.15 NOREF#45.1 NOREF#64.1 R7.2 U7.3
ANODE_7: ANODE7.1 H1.35 NOREF#82.1 NOREF#91.1 R12.2 U12.3
ANODE_8: ANODE8.1 H1.31 NOREF#86.1 NOREF#98.1 R17.2 U17.3
ANODE_9: ANODE9.1 H1.47 NOREF#15.1 NOREF#57.1 R22.2 U22.3
ANODE_10: ANODE10.1 H1.23 NOREF#5.1 NOREF#95.1 R3.2 U3.3
ANODE_11: ANODE11.1 H1.13 NOREF#51.1 NOREF#55.1 R8.2 U8.3
ANODE_12: ANODE12.1 H1.37 NOREF#52.1 NOREF#90.1 R13.2 U13.3
ANODE_13: ANODE13.1 H1.45 NOREF#74.1 NOREF#97.1 R18.2 U18.3
ANODE_14: ANODE14.1 H1.3 NOREF#16.1 NOREF#93.1 R23.2 U23.3
ANODE_15: ANODE15.1 H1.21 NOREF#13.1 NOREF#88.1 R4.2 U4.3
ANODE_16: ANODE16.1 H1.11 NOREF#27.1 NOREF#94.1 R9.2 U9.3
ANODE_17: ANODE17.1 H1.39 NOREF#6.1 NOREF#11.1 R14.2 U14.3
ANODE_18: ANODE18.1 H1.5 NOREF#63.1 NOREF#77.1 R19.2 U19.3
ANODE_19: ANODE19.1 H1.49 NOREF#34.1 NOREF#80.1 R24.2 U24.3
ANODE_20: ANODE20.1 H1.43 NOREF#72.1 NOREF#83.1 R5.2 U5.3
ANODE_21: ANODE21.1 H1.9 NOREF#9.1 NOREF#68.1 R10.2 U10.3
ANODE_22: ANODE22.1 H1.41 NOREF#7.1 NOREF#10.1 R15.2 U15.3
ANODE_23: ANODE23.1 H1.19 NOREF#35.1 NOREF#41.1 R20.2 U20.3
ANODE_24: ANODE24.1 H1.1 NOREF#17.1 NOREF#50.1 R25.2 U25.3
CATHODE_0: CATHODE0.1 H1.28 L1.2 NOREF#22.1 NOREF#42.1
CATHODE_1: CATHODE1.1 H1.18 L6.2 NOREF#46.1 NOREF#75.1
CATHODE_2: CATHODE2.1 H1.30 L11.2 NOREF#48.1 NOREF#84.1
CATHODE_3: CATHODE3.1 H1.8 L16.2 NOREF#47.1 NOREF#60.1
CATHODE_4: CATHODE4.1 H1.34 L21.2 NOREF#20.1 NOREF#37.1
CATHODE_5: CATHODE5.1 H1.26 L2.2 NOREF#24.1 NOREF#29.1
CATHODE_6: CATHODE6.1 H1.16 L7.2 NOREF#26.1 NOREF#36.1
CATHODE_7: CATHODE7.1 H1.36 L12.2 NOREF#33.1 NOREF#49.1
CATHODE_8: CATHODE8.1 H1.32 L17.2 NOREF#12.1 NOREF#28.1
CATHODE_9: CATHODE9.1 H1.48 L22.2 NOREF#2.1 NOREF#30.1
CATHODE_10: CATHODE10.1 H1.24 L3.2 NOREF#53.1 NOREF#70.1
CATHODE_11: CATHODE11.1 H1.14 L8.2 NOREF.1 NOREF#85.1
CATHODE_12: CATHODE12.1 H1.38 L13.2 NOREF#21.1 NOREF#65.1
CATHODE_13: CATHODE13.1 H1.46 L18.2 NOREF#32.1 NOREF#87.1
CATHODE_14: CATHODE14.1 H1.4 L23.2 NOREF#56.1 NOREF#73.1
CATHODE_15: CATHODE15.1 H1.22 L4.2 NOREF#23.1 NOREF#39.1
CATHODE_16: CATHODE16.1 H1.12 L9.2 NOREF#38.1 NOREF#92.1
CATHODE_17: CATHODE17.1 H1.40 L14.2 NOREF#8.1 NOREF#43.1
CATHODE_18: CATHODE18.1 H1.6 L19.2 NOREF#67.1 NOREF#89.1
CATHODE_19: CATHODE19.1 H1.50 L24.2 NOREF#58.1 NOREF#81.1
CATHODE_20: CATHODE20.1 H1.44 L5.2 NOREF#31.1 NOREF#99.1
CATHODE_21: CATHODE21.1 H1.10 L10.2 NOREF#14.1 NOREF#54.1
CATHODE_22: CATHODE22.1 H1.42 L15.2 NOREF#3.1 NOREF#96.1
CATHODE_23: CATHODE23.1 H1.20 L20.2 NOREF#19.1 NOREF#100.1
CATHODE_24: CATHODE24.1 H1.2 L25.2 NOREF#66.1 NOREF#76.1
CTRL: C201.2 R30.2 R31.2 U1.5 U2.5 U3.5 U4.5 U5.5 U6.5 U7.5 U8.5 U9.5 U10.5 U11.5 U12.5 U13.5 U14.5 U15.5 U16.5 U17.5 U18.5 U19.5 U20.5 U21.5 U22.5 U23.5 U24.5 U25.5
CTRL_IN: CN1.2 R30.1

Pads without a net: U1 4; U2 4; U3 4; U4 4; U5 4; U6 4; U7 4; U8 4; U9 4; U10 4; U11 4; U12 4; U13 4; U14 4; U15 4; U16 4; U17 4; U18 4; U19 4; U20 4; U21 4; U22 4; U23 4; U24 4; U25 4; U32 1; U33 1; U36 1; U37 1

## Via types
v1: diameter 0.61, hole 0.305, Top Layer to Bottom Layer, 906 vias

## Routing (per net, layer and track width the routed paths; a pad name or vN(x,y) marks a point on that pad's centre or on a via; arc(x,y) is an arc through that point)
GND:
  vias: v1(19.41,59.03) v1(19.41,58.03) v1(19.41,57.03) v1(19.41,56.03) v1(19.41,55.03) v1(19.41,54.03) v1(20.41,59.03) v1(20.41,58.03) v1(20.41,57.03) v1(20.41,56.03) v1(20.41,55.03) v1(20.41,54.03) v1(24.36,55.86) v1(24.36,54.86) v1(24.36,53.86) v1(25.36,55.86) v1(25.36,54.86) v1(25.36,53.86) v1(26.39,55.86) v1(26.39,54.86) v1(26.39,53.86) v1(27.39,55.86) v1(27.39,54.86) v1(27.39,53.86) v1(52.41,59.03) v1(52.41,58.03) v1(52.41,57.03) v1(52.41,56.03) v1(52.41,55.03) v1(52.41,54.03) v1(52.41,39.03) v1(52.41,38.03) v1(52.41,37.03) v1(52.41,36.03) v1(52.41,35.03) v1(52.41,34.03) v1(52.41,18.03) v1(52.41,17.03) v1(52.41,16.03) v1(52.41,15.03) v1(52.41,14.03) v1(52.41,13.03) v1(53.41,59.03) v1(53.41,58.03) v1(53.41,57.03) v1(53.41,56.03) v1(53.41,55.03) v1(53.41,54.03) v1(53.41,39.03) v1(53.41,38.03) v1(53.41,37.03) v1(53.41,36.03) v1(53.41,35.03) v1(53.41,34.03) v1(53.41,18.03) v1(53.41,17.03) v1(53.41,16.03) v1(53.41,15.03) v1(53.41,14.03) v1(53.41,13.03) v1(57.36,55.86) v1(57.36,54.86) v1(57.36,53.86) v1(57.36,35.86) v1(57.36,34.86) v1(57.36,33.86) v1(57.36,14.86) v1(57.36,13.86) v1(57.36,12.86) v1(58.36,55.86) v1(58.36,54.86) v1(58.36,53.86) v1(58.36,35.86) v1(58.36,34.86) v1(58.36,33.86) v1(58.36,14.86) v1(58.36,13.86) v1(58.36,12.86) v1(59.39,55.86) v1(59.39,54.86) v1(59.39,53.86) v1(59.39,35.86) v1(59.39,34.86) v1(59.39,33.86) v1(59.39,14.86) v1(59.39,13.86) v1(59.39,12.86) v1(60.39,55.86) v1(60.39,54.86) v1(60.39,53.86) v1(60.39,35.86) v1(60.39,34.86) v1(60.39,33.86) v1(60.39,14.86) v1(60.39,13.86) v1(60.39,12.86) v1(85.41,59.03) v1(85.41,58.03) v1(85.41,57.03) v1(85.41,56.03) v1(85.41,55.03) v1(85.41,54.03) v1(85.41,39.03) v1(85.41,38.03) v1(85.41,37.03) v1(85.41,36.03) v1(85.41,35.03) v1(85.41,34.03) v1(85.41,18.03) v1(85.41,17.03) v1(85.41,16.03) v1(85.41,15.03) v1(85.41,14.03) v1(85.41,13.03) v1(86.41,59.03) v1(86.41,58.03) v1(86.41,57.03) v1(86.41,56.03) v1(86.41,55.03) v1(86.41,54.03) v1(86.41,39.03) v1(86.41,38.03) v1(86.41,37.03) v1(86.41,36.03) v1(86.41,35.03) v1(86.41,34.03) v1(86.41,18.03) v1(86.41,17.03) v1(86.41,16.03) v1(86.41,15.03) v1(86.41,14.03) v1(86.41,13.03) v1(90.36,55.86) v1(90.36,54.86) v1(90.36,53.86) v1(90.36,35.86) v1(90.36,34.86) v1(90.36,33.86) v1(90.36,14.86) v1(90.36,13.86) v1(90.36,12.86) v1(91.36,55.86) v1(91.36,54.86) v1(91.36,53.86) v1(91.36,35.86) v1(91.36,34.86) v1(91.36,33.86) v1(91.36,14.86) v1(91.36,13.86) v1(91.36,12.86) v1(92.39,55.86) v1(92.39,54.86) v1(92.39,53.86) v1(92.39,35.86) v1(92.39,34.86) v1(92.39,33.86) v1(92.39,14.86) v1(92.39,13.86) v1(92.39,12.86) v1(93.39,55.86) v1(93.39,54.86) v1(93.39,53.86) v1(93.39,35.86) v1(93.39,34.86) v1(93.39,33.86) v1(93.39,14.86) v1(93.39,13.86) v1(93.39,12.86) v1(118.41,59.03) v1(118.41,58.03) v1(118.41,57.03) v1(118.41,56.03) v1(118.41,55.03) v1(118.41,54.03) v1(118.41,39.03) v1(118.41,38.03) v1(118.41,37.03) v1(118.41,36.03) v1(118.41,35.03) v1(118.41,34.03) v1(118.41,18.03) v1(118.41,17.03) v1(118.41,16.03) v1(118.41,15.03) v1(118.41,14.03) v1(118.41,13.03) v1(119.41,59.03) v1(119.41,58.03) v1(119.41,57.03) v1(119.41,56.03) v1(119.41,55.03) v1(119.41,54.03) v1(119.41,39.03) v1(119.41,38.03) v1(119.41,37.03) v1(119.41,36.03) v1(119.41,35.03) v1(119.41,34.03) v1(119.41,18.03) v1(119.41,17.03) v1(119.41,16.03) v1(119.41,15.03) v1(119.41,14.03) v1(119.41,13.03) v1(123.36,55.86) v1(123.36,54.86) v1(123.36,53.86) v1(123.36,35.86) v1(123.36,34.86) v1(123.36,33.86) v1(123.36,14.86) v1(123.36,13.86) v1(123.36,12.86) v1(124.36,55.86) v1(124.36,54.86) v1(124.36,53.86) v1(124.36,35.86) v1(124.36,34.86) v1(124.36,33.86) v1(124.36,14.86) v1(124.36,13.86) v1(124.36,12.86) v1(125.39,55.86) v1(125.39,54.86) v1(125.39,53.86) v1(125.39,35.86) v1(125.39,34.86) v1(125.39,33.86) v1(125.39,14.86) v1(125.39,13.86) v1(125.39,12.86) v1(126.39,55.86) v1(126.39,54.86) v1(126.39,53.86) v1(126.39,35.86) v1(126.39,34.86) v1(126.39,33.86) v1(126.39,14.86) v1(126.39,13.86) v1(126.39,12.86) v1(151.41,59.03) v1(151.41,58.03) v1(151.41,57.03) v1(151.41,56.03) v1(151.41,55.03) v1(151.41,54.03) v1(151.41,39.03) v1(151.41,38.03) v1(151.41,37.03) v1(151.41,36.03) v1(151.41,35.03) v1(151.41,34.03) v1(151.41,18.03) v1(151.41,17.03) v1(151.41,16.03) v1(151.41,15.03) v1(151.41,14.03) v1(151.41,13.03) v1(152.41,59.03) v1(152.41,58.03) v1(152.41,57.03) v1(152.41,56.03) v1(152.41,55.03) v1(152.41,54.03) v1(152.41,39.03) v1(152.41,38.03) v1(152.41,37.03) v1(152.41,36.03) v1(152.41,35.03) v1(152.41,34.03) v1(152.41,18.03) v1(152.41,17.03) v1(152.41,16.03) v1(152.41,15.03) v1(152.41,14.03) v1(152.41,13.03) v1(156.36,55.86) v1(156.36,54.86) v1(156.36,53.86) v1(156.36,35.86) v1(156.36,34.86) v1(156.36,33.86) v1(156.36,14.86) v1(156.36,13.86) v1(156.36,12.86) v1(157.36,55.86) v1(157.36,54.86) v1(157.36,53.86) v1(157.36,35.86) v1(157.36,34.86) v1(157.36,33.86) v1(157.36,14.86) v1(157.36,13.86) v1(157.36,12.86) v1(158.39,55.86) v1(158.39,54.86) v1(158.39,53.86) v1(158.39,35.86) v1(158.39,34.86) v1(158.39,33.86) v1(158.39,14.86) v1(158.39,13.86) v1(158.39,12.86) v1(159.39,55.86) v1(159.39,54.86) v1(159.39,53.86) v1(159.39,35.86) v1(159.39,34.86) v1(159.39,33.86) v1(159.39,14.86) v1(159.39,13.86) v1(159.39,12.86) v1(183.41,59.03) v1(183.41,58.03) v1(183.41,57.03) v1(183.41,56.03) v1(183.41,55.03) v1(183.41,54.03) v1(183.41,39.03) v1(183.41,38.03) v1(183.41,37.03) v1(183.41,36.03) v1(183.41,35.03) v1(183.41,34.03) v1(183.41,18.03) v1(183.41,17.03) v1(183.41,16.03) v1(183.41,15.03) v1(183.41,14.03) v1(183.41,13.03) v1(184.41,59.03) v1(184.41,58.03) v1(184.41,57.03) v1(184.41,56.03) v1(184.41,55.03) v1(184.41,54.03) v1(184.41,39.03) v1(184.41,38.03) v1(184.41,37.03) v1(184.41,36.03) v1(184.41,35.03) v1(184.41,34.03) v1(184.41,18.03) v1(184.41,17.03) v1(184.41,16.03) v1(184.41,15.03) v1(184.41,14.03) v1(184.41,13.03) v1(188.36,55.86) v1(188.36,54.86) v1(188.36,53.86) v1(188.36,35.86) v1(188.36,34.86) v1(188.36,33.86) v1(188.36,14.86) v1(188.36,13.86) v1(188.36,12.86) v1(189.36,55.86) v1(189.36,54.86) v1(189.36,53.86) v1(189.36,35.86) v1(189.36,34.86) v1(189.36,33.86) v1(189.36,14.86) v1(189.36,13.86) v1(189.36,12.86) v1(190.39,55.86) v1(190.39,54.86) v1(190.39,53.86) v1(190.39,35.86) v1(190.39,34.86) v1(190.39,33.86) v1(190.39,14.86) v1(190.39,13.86) v1(190.39,12.86) v1(191.39,55.86) v1(191.39,54.86) v1(191.39,53.86) v1(191.39,35.86) v1(191.39,34.86) v1(191.39,33.86) v1(191.39,14.86) v1(191.39,13.86) v1(191.39,12.86) v1(215.41,59.03) v1(215.41,58.03) v1(215.41,57.03) v1(215.41,56.03) v1(215.41,55.03) v1(215.41,54.03) v1(215.41,39.03) v1(215.41,38.03) v1(215.41,37.03) v1(215.41,36.03) v1(215.41,35.03) v1(215.41,34.03) v1(215.41,18.03) v1(215.41,17.03) v1(215.41,16.03) v1(215.41,15.03) v1(215.41,14.03) v1(215.41,13.03) v1(216.41,59.03) v1(216.41,58.03) v1(216.41,57.03) v1(216.41,56.03) v1(216.41,55.03) v1(216.41,54.03) v1(216.41,39.03) v1(216.41,38.03) v1(216.41,37.03) v1(216.41,36.03) v1(216.41,35.03) v1(216.41,34.03) v1(216.41,18.03) v1(216.41,17.03) v1(216.41,16.03) v1(216.41,15.03) v1(216.41,14.03) v1(216.41,13.03) v1(220.36,55.86) v1(220.36,54.86) v1(220.36,53.86) v1(220.36,35.86) v1(220.36,34.86) v1(220.36,33.86) v1(220.36,14.86) v1(220.36,13.86) v1(220.36,12.86) v1(221.36,55.86) v1(221.36,54.86) v1(221.36,53.86) v1(221.36,35.86) v1(221.36,34.86) v1(221.36,33.86) v1(221.36,14.86) v1(221.36,13.86) v1(221.36,12.86) v1(222.39,55.86) v1(222.39,54.86) v1(222.39,53.86) v1(222.39,35.86) v1(222.39,34.86) v1(222.39,33.86) v1(222.39,14.86) v1(222.39,13.86) v1(222.39,12.86) v1(223.39,55.86) v1(223.39,54.86) v1(223.39,53.86) v1(223.39,35.86) v1(223.39,34.86) v1(223.39,33.86) v1(223.39,14.86) v1(223.39,13.86) v1(223.39,12.86) v1(247.41,59.03) v1(247.41,58.03) v1(247.41,57.03) v1(247.41,56.03) v1(247.41,55.03) v1(247.41,54.03) v1(247.41,39.03) v1(247.41,38.03) v1(247.41,37.03) v1(247.41,36.03) v1(247.41,35.03) v1(247.41,34.03) v1(247.41,18.03) v1(247.41,17.03) v1(247.41,16.03) v1(247.41,15.03) v1(247.41,14.03) v1(247.41,13.03) v1(248.41,59.03) v1(248.41,58.03) v1(248.41,57.03) v1(248.41,56.03) v1(248.41,55.03) v1(248.41,54.03) v1(248.41,39.03) v1(248.41,38.03) v1(248.41,37.03) v1(248.41,36.03) v1(248.41,35.03) v1(248.41,34.03) v1(248.41,18.03) v1(248.41,17.03) v1(248.41,16.03) v1(248.41,15.03) v1(248.41,14.03) v1(248.41,13.03) v1(252.36,55.86) v1(252.36,54.86) v1(252.36,53.86) v1(252.36,35.86) v1(252.36,34.86) v1(252.36,33.86) v1(252.36,14.86) v1(252.36,13.86) v1(252.36,12.86) v1(253.36,55.86) v1(253.36,54.86) v1(253.36,53.86) v1(253.36,35.86) v1(253.36,34.86) v1(253.36,33.86) v1(253.36,14.86) v1(253.36,13.86) v1(253.36,12.86) v1(254.39,55.86) v1(254.39,54.86) v1(254.39,53.86) v1(254.39,35.86) v1(254.39,34.86) v1(254.39,33.86) v1(254.39,14.86) v1(254.39,13.86) v1(254.39,12.86) v1(255.39,55.86) v1(255.39,54.86) v1(255.39,53.86) v1(255.39,35.86) v1(255.39,34.86) v1(255.39,33.86) v1(255.39,14.86) v1(255.39,13.86) v1(255.39,12.86) v1(279.41,59.03) v1(279.41,58.03) v1(279.41,57.03) v1(279.41,56.03) v1(279.41,55.03) v1(279.41,54.03) v1(279.41,39.03) v1(279.41,38.03) v1(279.41,37.03) v1(279.41,36.03) v1(279.41,35.03) v1(279.41,34.03) v1(279.41,18.03) v1(279.41,17.03) v1(279.41,16.03) v1(279.41,15.03) v1(279.41,14.03) v1(279.41,13.03) v1(280.41,59.03) v1(280.41,58.03) v1(280.41,57.03) v1(280.41,56.03) v1(280.41,55.03) v1(280.41,54.03) v1(280.41,39.03) v1(280.41,38.03) v1(280.41,37.03) v1(280.41,36.03) v1(280.41,35.03) v1(280.41,34.03) v1(280.41,18.03) v1(280.41,17.03) v1(280.41,16.03) v1(280.41,15.03) v1(280.41,14.03) v1(280.41,13.03) v1(284.36,55.86) v1(284.36,54.86) v1(284.36,53.86) v1(284.36,35.86) v1(284.36,34.86) v1(284.36,33.86) v1(284.36,14.86) v1(284.36,13.86) v1(284.36,12.86) v1(285.36,55.86) v1(285.36,54.86) v1(285.36,53.86) v1(285.36,35.86) v1(285.36,34.86) v1(285.36,33.86) v1(285.36,14.86) v1(285.36,13.86) v1(285.36,12.86) v1(286.39,55.86) v1(286.39,54.86) v1(286.39,53.86) v1(286.39,35.86) v1(286.39,34.86) v1(286.39,33.86) v1(286.39,14.86) v1(286.39,13.86) v1(286.39,12.86) v1(287.39,55.86) v1(287.39,54.86) v1(287.39,53.86) v1(287.39,35.86) v1(287.39,34.86) v1(287.39,33.86) v1(287.39,14.86) v1(287.39,13.86) v1(287.39,12.86)
VCC: length 63.8
  Top Layer w0.65: C15.2 210.77,16 U13.6 ; U2.6 210.77,37 C4.2 ; U12.6 178.77,16 C14.2 ; C9.2 178.77,57 U7.6 ; C22.2 47.77,37 U20.6 ; U19.6 80.77,57 C21.2 ; C5.2 242.77,37 U3.6 ; U25.6 14.77,57 C27.2 ; C3.2 178.77,37 U1.6 ; U5.6 146.77,16 C7.2 ; C16.2 242.77,16 U14.6 ; U17.6 113.77,37 C19.2 ; C18.2 113.77,57 U16.6 ; C8.2 146.77,57 U6.6 ; U8.6 210.77,57 C10.2 ; U18.6 113.77,16 C20.2 ; C11.2 242.77,57 U9.6 ; C13.2 146.77,37 U11.6 ; C26.2 47.77,16 U24.6 ; U10.6 274.77,57 C12.2 ; C17.2 274.77,16 U15.6 ; U23.6 47.77,57 C25.2 ; U22.6 80.77,16 C24.2 ; C23.2 80.77,37 U21.6 ; U4.6 274.77,37 C6.2
  vias: v1(7.3,61.35) v1(7.3,60.35) v1(7.3,59.35) v1(8.3,61.35) v1(8.3,60.35) v1(8.3,59.35) v1(9.33,61.35) v1(9.33,60.35) v1(9.33,59.35) v1(10.33,61.35) v1(10.33,60.35) v1(10.33,59.35) v1(36.1,39.45) v1(36.3,18.45) v1(37.1,39.45) v1(37.3,18.45) v1(38.13,39.45) v1(38.33,18.45) v1(39.13,39.45) v1(39.33,18.45) v1(40.1,40.45) v1(40.1,39.45) v1(40.3,19.45) v1(40.3,18.45) v1(40.4,61.35) v1(40.4,60.35) v1(40.4,59.35) v1(41.1,40.45) v1(41.1,39.45) v1(41.3,19.45) v1(41.3,18.45) v1(41.4,61.35) v1(41.4,60.35) v1(41.4,59.35) v1(42.13,40.45) v1(42.13,39.45) v1(42.33,19.45) v1(42.33,18.45) v1(42.43,61.35) v1(42.43,60.35) v1(42.43,59.35) v1(43.13,40.45) v1(43.13,39.45) v1(43.33,19.45) v1(43.33,18.45) v1(43.43,61.35) v1(43.43,60.35) v1(43.43,59.35) v1(68.9,39.45) v1(69.4,18.35) v1(69.9,39.45) v1(70.4,18.35) v1(70.93,39.45) v1(71.43,18.35) v1(71.93,39.45) v1(72.43,18.35) v1(72.9,40.45) v1(72.9,39.45) v1(73.3,61.35) v1(73.3,60.35) v1(73.3,59.35) v1(73.4,19.35) v1(73.4,18.35) v1(73.9,40.45) v1(73.9,39.45) v1(74.3,61.35) v1(74.3,60.35) v1(74.3,59.35) v1(74.4,19.35) v1(74.4,18.35) v1(74.93,40.45) v1(74.93,39.45) v1(75.33,61.35) v1(75.33,60.35) v1(75.33,59.35) v1(75.43,19.35) v1(75.43,18.35) v1(75.93,40.45) v1(75.93,39.45) v1(76.33,61.35) v1(76.33,60.35) v1(76.33,59.35) v1(76.43,19.35) v1(76.43,18.35) v1(102.2,59.35) v1(102.2,39.45) v1(102.4,18.35) v1(103.2,59.35) v1(103.2,39.45) v1(103.4,18.35) v1(104.23,59.35) v1(104.23,39.45) v1(104.43,18.35) v1(105.23,59.35) v1(105.23,39.45) v1(105.43,18.35) v1(106.2,59.35) v1(106.2,40.45) v1(106.2,39.45) v1(106.4,19.35) v1(106.4,18.35) v1(107.2,59.35) v1(107.2,40.45) v1(107.2,39.45) v1(107.4,19.35) v1(107.4,18.35) v1(108.23,59.35) v1(108.23,40.45) v1(108.23,39.45) v1(108.43,19.35) v1(108.43,18.35) v1(109.23,59.35) v1(109.23,40.45) v1(109.23,39.45) v1(109.43,19.35) v1(109.43,18.35) v1(135.1,39.45) v1(135.4,18.45) v1(135.5,59.35) v1(136.1,39.45) v1(136.4,18.45) v1(136.5,59.35) v1(137.13,39.45) v1(137.43,18.45) v1(137.53,59.35) v1(138.13,39.45) v1(138.43,18.45) v1(138.53,59.35) v1(139.1,40.45) v1(139.1,39.45) v1(139.4,19.45) v1(139.4,18.45) v1(139.5,59.35) v1(140.1,40.45) v1(140.1,39.45) v1(140.4,19.45) v1(140.4,18.45) v1(140.5,59.35) v1(141.13,40.45) v1(141.13,39.45) v1(141.43,19.45) v1(141.43,18.45) v1(141.53,59.35) v1(142.13,40.45) v1(142.13,39.45) v1(142.43,19.45) v1(142.43,18.45) v1(142.53,59.35) v1(166.9,39.35) v1(167.3,59.35) v1(167.3,18.45) v1(167.9,39.35) v1(168.3,59.35) v1(168.3,18.45) v1(168.93,39.35) v1(169.33,59.35) v1(169.33,18.45) v1(169.93,39.35) v1(170.33,59.35) v1(170.33,18.45) v1(170.9,40.35) v1(170.9,39.35) v1(171.3,59.35) v1(171.3,19.45) v1(171.3,18.45) v1(171.9,40.35) v1(171.9,39.35) v1(172.3,59.35) v1(172.3,19.45) v1(172.3,18.45) v1(172.93,40.35) v1(172.93,39.35) v1(173.33,59.35) v1(173.33,19.45) v1(173.33,18.45) v1(173.93,40.35) v1(173.93,39.35) v1(174.33,59.35) v1(174.33,19.45) v1(174.33,18.45) v1(199,39.35) v1(199.2,18.35) v1(199.4,59.35) v1(200,39.35) v1(200.2,18.35) v1(200.4,59.35) v1(201.03,39.35) v1(201.23,18.35) v1(201.43,59.35) v1(202.03,39.35) v1(202.23,18.35) v1(202.43,59.35) v1(203,40.35) v1(203,39.35) v1(203.2,19.35) v1(203.2,18.35) v1(203.4,59.35) v1(204,40.35) v1(204,39.35) v1(204.2,19.35) v1(204.2,18.35) v1(204.4,59.35) v1(205.03,40.35) v1(205.03,39.35) v1(205.23,19.35) v1(205.23,18.35) v1(205.43,59.35) v1(206.03,40.35) v1(206.03,39.35) v1(206.23,19.35) v1(206.23,18.35) v1(206.43,59.35) v1(231.3,59.35) v1(231.4,39.35) v1(231.4,18.45) v1(232.3,59.35) v1(232.4,39.35) v1(232.4,18.45) v1(233.33,59.35) v1(233.43,39.35) v1(233.43,18.45) v1(234.33,59.35) v1(234.43,39.35) v1(234.43,18.45) v1(235.3,59.35) v1(235.4,40.35) v1(235.4,39.35) v1(235.4,19.45) v1(235.4,18.45) v1(236.3,59.35) v1(236.4,40.35) v1(236.4,39.35) v1(236.4,19.45) v1(236.4,18.45) v1(237.33,59.35) v1(237.43,40.35) v1(237.43,39.35) v1(237.43,19.45) v1(237.43,18.45) v1(238.33,59.35) v1(238.43,40.35) v1(238.43,39.35) v1(238.43,19.45) v1(238.43,18.45) v1(263.2,18.45) v1(263.5,59.25) v1(263.5,39.35) v1(264.2,18.45) v1(264.5,59.25) v1(264.5,39.35) v1(265.23,18.45) v1(265.53,59.25) v1(265.53,39.35) v1(266.23,18.45) v1(266.53,59.25) v1(266.53,39.35) v1(267.2,19.45) v1(267.2,18.45) v1(267.5,59.25) v1(267.5,40.35) v1(267.5,39.35) v1(268.2,19.45) v1(268.2,18.45) v1(268.5,59.25) v1(268.5,40.35) v1(268.5,39.35) v1(269.23,19.45) v1(269.23,18.45) v1(269.53,59.25) v1(269.53,40.35) v1(269.53,39.35) v1(270.23,19.45) v1(270.23,18.45) v1(270.53,59.25) v1(270.53,40.35) v1(270.53,39.35)
ANODE_0: length 111.4
  Inner2 w0.5: 194.8,35.75 193.49,35.75 NOREF#79.1 ; 194.8,35.75 203.53,27.02 292.71,27.02 293.64,27.96 295.5,27.96 296.75,29.21 H1.27 ; 194.8,35.75 193.8,36.75 NOREF#40.1
ANODE_1: length 146
  Inner2 w0.5: 162.99,55.51 NOREF#44.1 ; 162.99,55.51 161.72,55.51 NOREF#18.1 ; 162.99,55.51 175.58,42.92 289.56,42.92 291.82,40.66 296.31,40.66 297.52,41.87 H1.17
